# EasyEDA Pro project ProDoc_PCB2_2025-05-25.epro

# Board PCB2
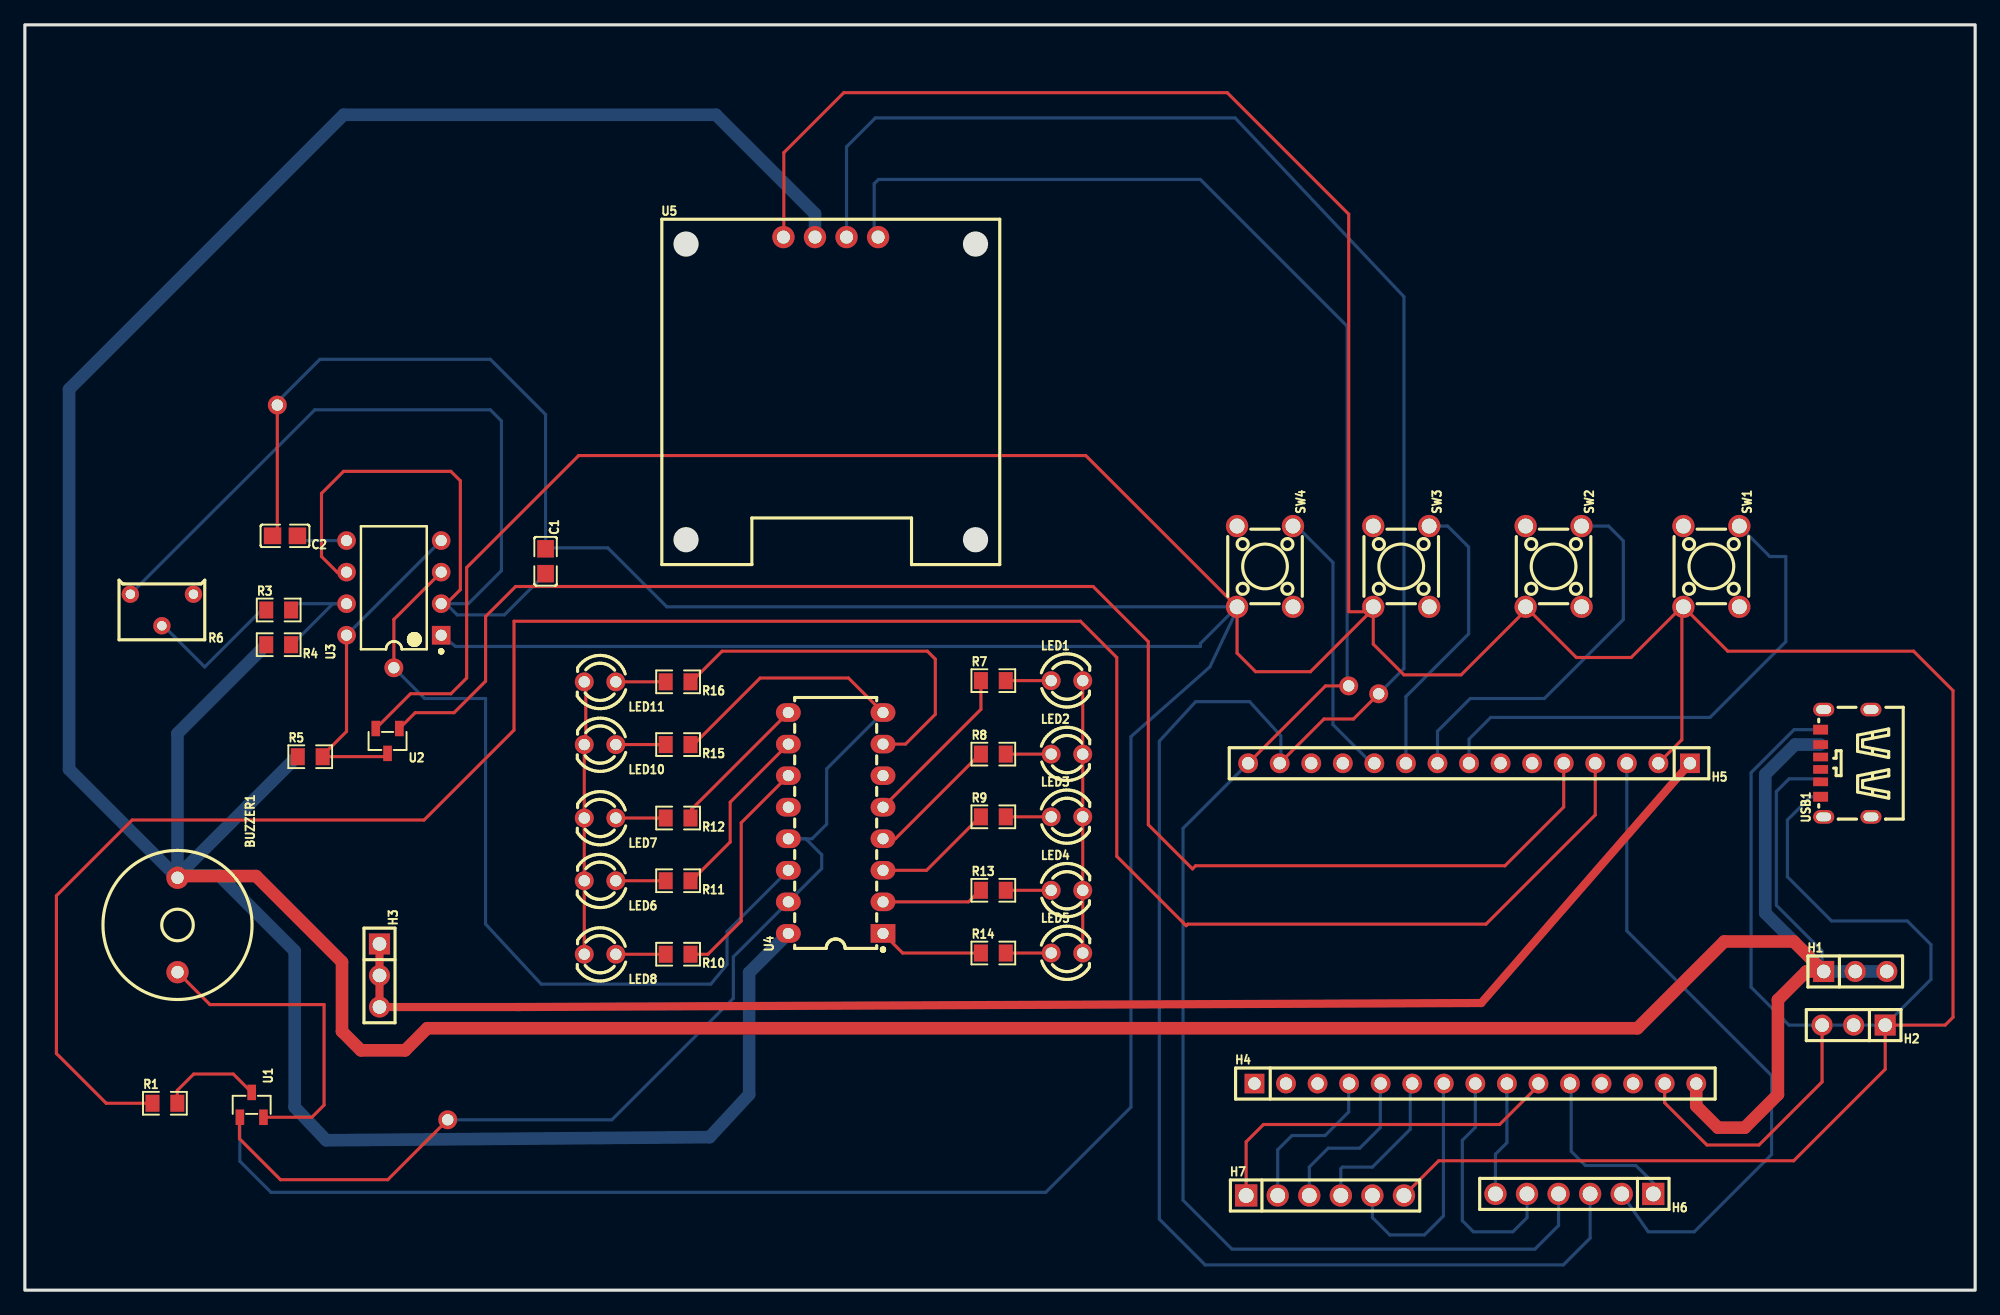
[diagram p0: board, top side]
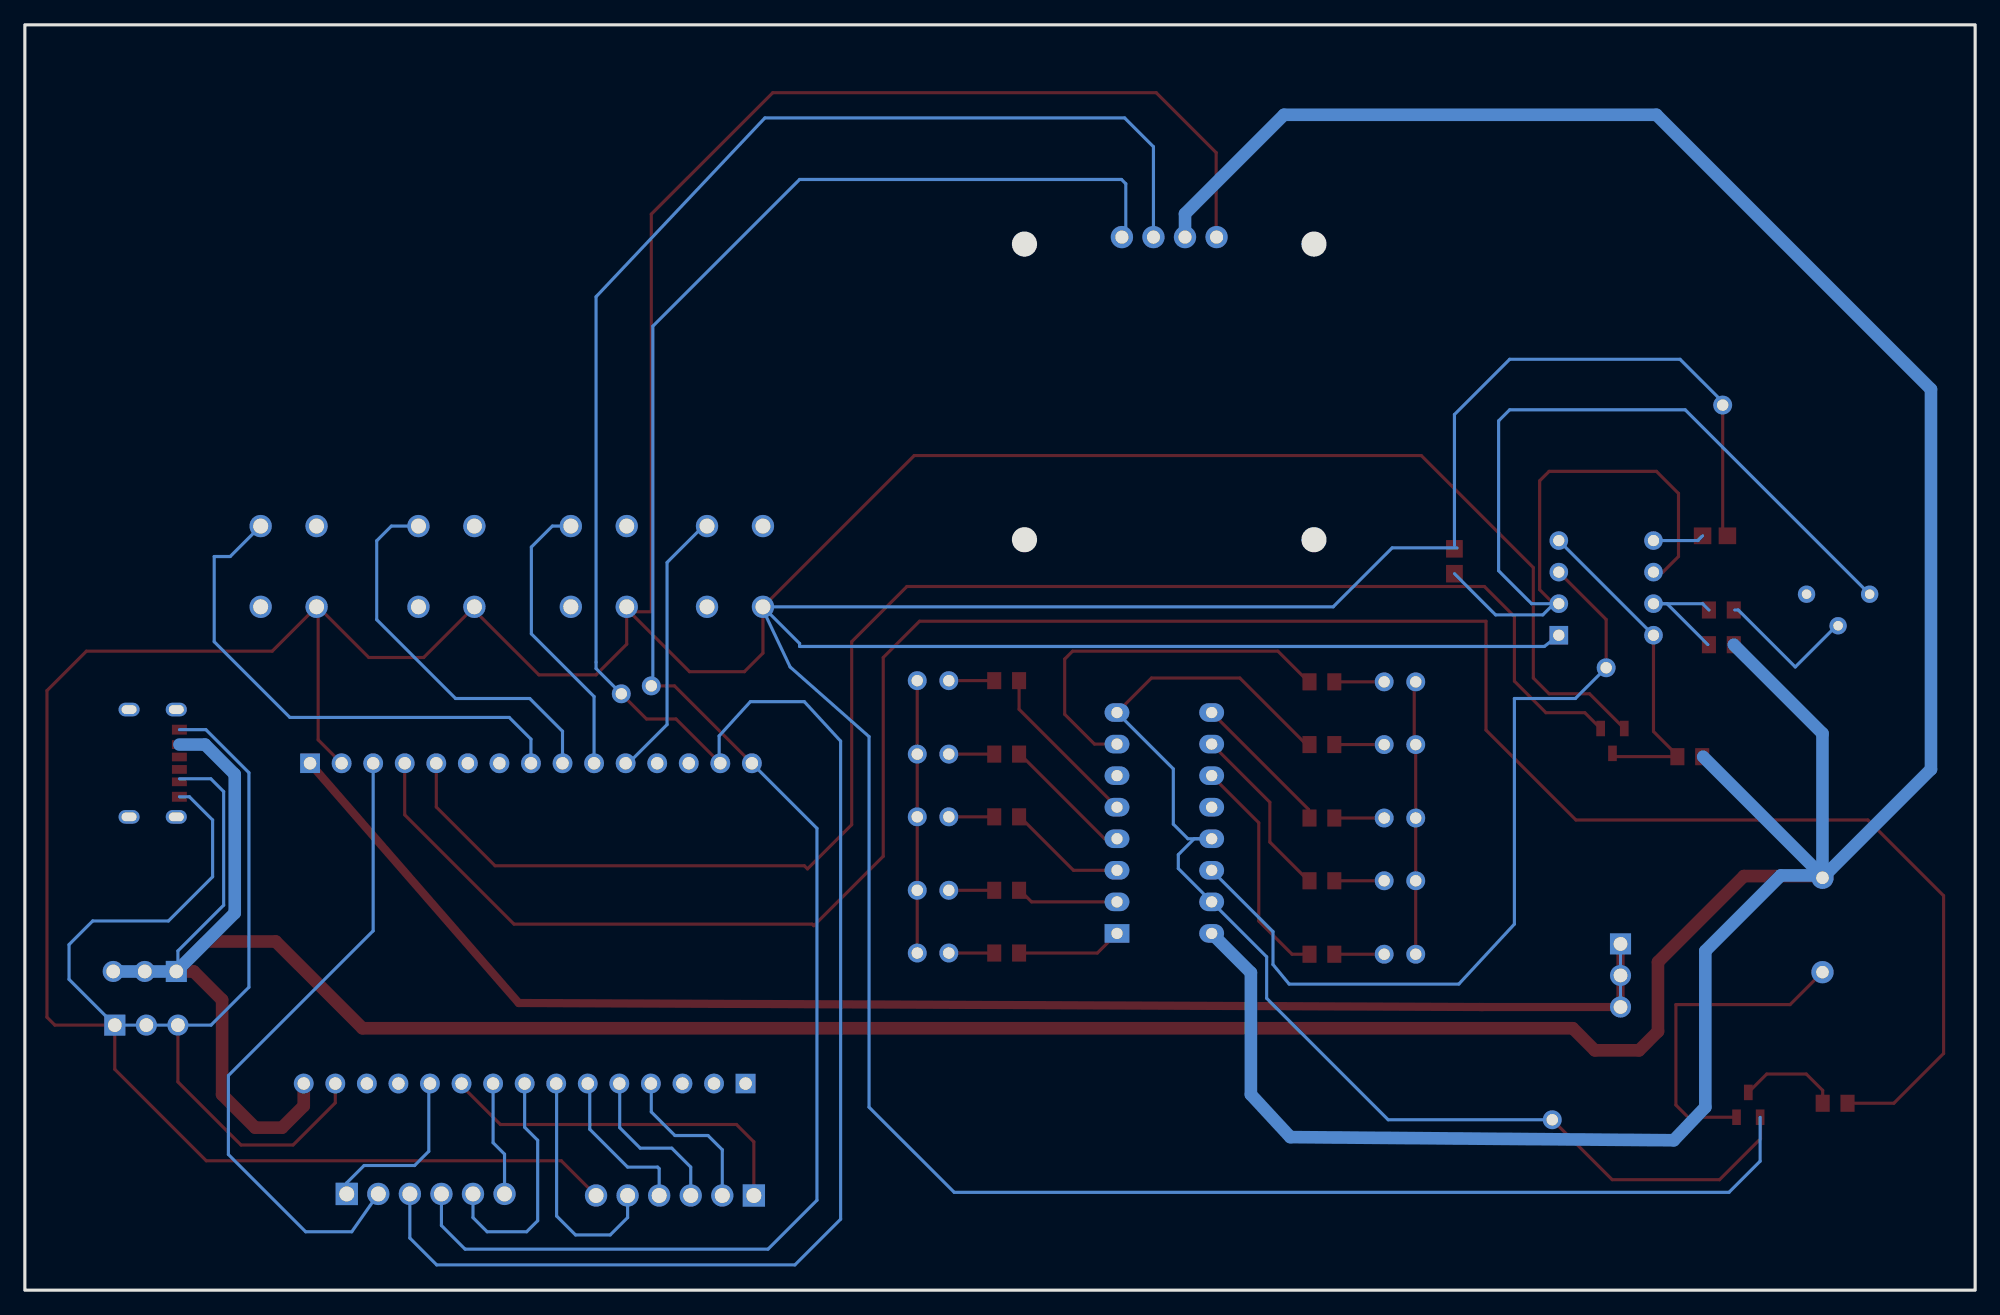
[diagram p1: board, bottom side, seen from below]

Outline 156.97 x 101.85 mm; copper layers: Top Layer, Bottom Layer. Coordinates in mm from the lower left corner of the outline.
Outline path: rectangle 0,101.85 156.97,0
Stack: Top Layer 0.035mm / Dielectric1 1.51mm FR4 er 4.5 / Bottom Layer 0.035mm

## Design rules (mm)
template: JLCPCB Capability(Two Layers Board)
spacing copperThickness1oz (default): track to track 0.102, other pairs 0.152 to 0.3
spacing copperThickness2oz: track to track 0.203, other pairs 0.152 to 0.3
track width copperThickness1oz (default): min 0.127, default 0.254, max 2.54
track width copperThickness2oz: min 0.203, default 0.254, max 2.54
differential pair differentialPair (default): width min 0.127, default 0.254, max 2.54; gap min 0.152, default 0.152
via viaSize (default): diameter min 0.5, default 0.61, max 10; hole min 0.3, default 0.305, max 6.3

## Placement (name value [footprint] x y rotation side)
BUZZER1  2.7kHz  [BUZ-TH_BD12.0-P7.60-D0.6-FD]  12.29 29.4 270 top
C1  10nF  [C0805]  41.91 58.67 270 top
C2  1uF  [C0805]  20.94 60.72 180 top
H1  PZ254V-11-03P  [HDR-TH_3P-P2.54-V-M]  147.32 25.65 0 top
H2  PZ254V-11-03P  [HDR-TH_3P-P2.54-V-M]  147.19 21.34 180 top
H3  PZ254V-11-03P  [HDR-TH_3P-P2.54-V-M]  28.54 25.33 270 top
H4  B-2200S15P-A120  [HDR-TH_15P-P2.54-V-F-1]  116.75 16.63 0 top
H5  B-2200S15P-A120  [HDR-TH_15P-P2.54-V-F-1]  116.24 42.41 180 top
H6  2.54-1x6P直针  [HDR-TH_6P-P2.54-V-M-1]  124.71 7.75 180 top
H7  2.54-1x6P直针  [HDR-TH_6P-P2.54-V-M-1]  104.65 7.62 0 top
LED1  204-10SURD/S530-A3  [LED-TH_BD3.0-P2.54-FD]  83.88 49.06 0 top
LED2  204-10SURD/S530-A3  [LED-TH_BD3.0-P2.54-FD]  83.88 43.15 0 top
LED3  204-10SURD/S530-A3  [LED-TH_BD3.0-P2.54-FD]  83.88 38.1 0 top
LED4  204-10SURD/S530-A3  [LED-TH_BD3.0-P2.54-FD]  83.88 32.19 0 top
LED5  204-10SURD/S530-A3  [LED-TH_BD3.0-P2.54-FD]  83.88 27.14 0 top
LED6  204-10SURD/S530-A3  [LED-TH_BD3.0-P2.54-FD]  46.3 32.96 180 top
LED7  204-10SURD/S530-A3  [LED-TH_BD3.0-P2.54-FD]  46.3 38 180 top
LED8  204-10SURD/S530-A3  [LED-TH_BD3.0-P2.54-FD]  46.3 27.04 180 top
LED10  204-10SURD/S530-A3  [LED-TH_BD3.0-P2.54-FD]  46.3 43.92 180 top
LED11  204-10SURD/S530-A3  [LED-TH_BD3.0-P2.54-FD]  46.3 48.97 180 top
NOREF  -  [Pad_e167]  34.04 13.72 0 top
NOREF#2  -  [Pad_e129]  108.97 48.01 0 top
NOREF#3  -  [Pad_e112]  29.7 50.1 0 top
NOREF#4  -  [Pad_e118]  20.32 71.25 0 top
NOREF#5  -  [Pad_e131]  106.55 48.64 0 top
R1  2.2kΩ  [R0805]  11.27 15.05 0 top
R3  10kΩ  [R0805]  20.43 54.75 0 top
R4  2.2kΩ  [R0805]  20.43 51.96 180 top
R5  22Ω  [R0805]  22.97 42.94 0 top
R6  500kΩ  [RES-ADJ-TH_3P-L7.1-W6.9-P2.54-BL-BS]  11.03 54.75 180 top
R7  470Ω  [R0805]  77.95 49.06 0 top
R8  470Ω  [R0805]  77.95 43.15 0 top
R9  470Ω  [R0805]  77.95 38.1 0 top
R10  470Ω  [R0805]  52.58 27.04 180 top
R11  470Ω  [R0805]  52.58 32.96 180 top
R12  470Ω  [R0805]  52.58 38 180 top
R13  470Ω  [R0805]  77.95 32.19 0 top
R14  470Ω  [R0805]  77.95 27.14 0 top
R15  470Ω  [R0805]  52.58 43.92 180 top
R16  470Ω  [R0805]  52.58 48.97 180 top
SW1  TS665CJ  [SW-TH_4P-L6.0-W6.0-P4.50-LS6.5]  135.74 58.26 270 top
SW2  TS665CJ  [SW-TH_4P-L6.0-W6.0-P4.50-LS6.5]  123.04 58.26 270 top
SW3  TS665CJ  [SW-TH_4P-L6.0-W6.0-P4.50-LS6.5]  110.78 58.26 270 top
SW4  TS665CJ  [SW-TH_4P-L6.0-W6.0-P4.50-LS6.5]  99.82 58.26 270 top
U1  SS8050  [SOT-23-3_L2.9-W1.3-P1.90-LS2.4-BR]  18.26 14.92 270 top
U2  2N7002K  [SOT-23-3_L2.9-W1.3-P1.90-LS2.4-BL-1]  29.19 44.21 180 top
U3  NE555N  [DIP-8_L9.8-W6.6-P2.54-LS7.6-BL]  29.7 56.53 90 top
U4  CD4017BE  [DIP-16_16P-L20.2-W6.6-P2.54-LS7.6-BL]  65.26 37.61 90 top
U5  HS96L03W2C03  [OLED-TH_L27.8-W27.2-P2.54_C9900033791]  64.87 84.77 0 top
USB1  TYPE-C 6P(073)  [TYPE-C-SMD_TYPE-C-6P_5]  146.56 42.42 90 top

## Footprints (pads in the part's own frame, mm; a bottom-side part is the same pattern mirrored in y, then rotated)
BUZ-TH_BD12.0-P7.60-D0.6-FD
  round 1.8 hole 1: 1(-3.8,0) 2(3.8,0)
C0805
  rect 1.41x1.35 smd: 1(-1,0) 2(1,0)
DIP-8_L9.8-W6.6-P2.54-LS7.6-BL
  rect 1.5x1.5 hole 0.9: 1(-3.81,-3.81)
  round 1.5 hole 0.9: 2(-1.27,-3.81) 3(1.27,-3.81) 4(3.81,-3.81) 5(3.81,3.81) 6(1.27,3.81) 7(-1.27,3.81) 8(-3.81,3.81)
DIP-16_16P-L20.2-W6.6-P2.54-LS7.6-BL
  rect 1.5x2 hole 0.9: 1(-8.89,-3.81)
  oval 1.5x2 hole 0.9: 2(-6.35,-3.81) 3(-3.81,-3.81) 4(-1.27,-3.81) 5(1.27,-3.81) 6(3.81,-3.81) 7(6.35,-3.81) 8(8.89,-3.81) 9(8.89,3.81) 10(6.35,3.81) 11(3.81,3.81) 12(1.27,3.81) 13(-1.27,3.81) 14(-3.81,3.81) 15(-6.35,3.81) 16(-8.89,3.81)
HDR-TH_3P-P2.54-V-M
  rect 1.7x1.7 hole 1.1: 1(-2.54,0)
  round 1.7 hole 1.1: 2(0,0) 3(2.54,0)
HDR-TH_6P-P2.54-V-M-1
  rect 1.8x1.8 hole 1.2: 1(-6.35,0)
  round 1.8 hole 1.2: 2(-3.81,0) 3(-1.27,0) 4(1.27,0) 5(3.81,0) 6(6.35,0)
HDR-TH_15P-P2.54-V-F-1
  rect 1.6x1.575 hole 1: 1(-17.78,0)
  round 1.6 hole 1: 2(-15.24,0) 3(-12.7,0) 4(-10.16,0) 5(-7.62,0) 6(-5.08,0) 7(-2.54,0) 8(0,0) 9(2.54,0) 10(5.08,0) 11(7.62,0) 12(10.16,0) 13(12.7,0) 14(15.24,0) 15(17.78,0)
LED-TH_BD3.0-P2.54-FD
  round 1.524 hole 0.914: 1(-1.27,0) 2(1.27,0)
OLED-TH_L27.8-W27.2-P2.54_C9900033791
  round 1.8 hole 1.05: 1(-3.81,0) 2(-1.27,0) 3(1.27,0) 4(3.81,0)
Pad_e112
  round 1.524 hole 0.914: 1(0,0)
Pad_e118
  round 1.524 hole 0.914: 1(0,0)
Pad_e129
  round 1.524 hole 0.914: 1(0,0)
Pad_e131
  round 1.524 hole 0.914: 1(0,0)
Pad_e167
  round 1.524 hole 0.914: 1(0,0)
R0805
  rect 1.133x1.377 smd: 1(-1,0) 2(1,0)
RES-ADJ-TH_3P-L7.1-W6.9-P2.54-BL-BS
  round 1.4 hole 0.762: 1(-2.54,-1.27) 2(0,1.27) 3(2.54,-1.27)
SOT-23-3_L2.9-W1.3-P1.90-LS2.4-BL-1
  rect 0.7x1.25 smd: 1(-0.95,-1) 2(0.95,-1) 3(0,1)
SOT-23-3_L2.9-W1.3-P1.90-LS2.4-BR
  rect 1.25x0.7 smd: 1(1,-0.95) 2(1,0.95) 3(-1,0)
SW-TH_4P-L6.0-W6.0-P4.50-LS6.5
  round 1.8 hole 1.2: 1(-3.25,2.25) 2(3.25,2.25) 3(-3.25,-2.25) 4(3.25,-2.25)
TYPE-C-SMD_TYPE-C-6P_5
  oval 1.1x1.7 hole 0.7x1.2: 7(-4.32,1.775) 7(-4.32,-2.025) 7(4.32,1.775) 7(4.32,-2.025)
  rect 0.7x1.2 smd: A5(-0.5,2.025) A9(1.5,2.025) B5(0.5,2.025) B9(-1.5,2.025)
  rect 0.8x1.2 smd: A12(2.7,2.025) B12(-2.7,2.025)

## Nets
GND: LED1.2 LED2.2 LED3.2 LED4.2 LED5.2 LED6.2 LED7.2 LED8.2 LED10.2 LED11.2
BEEP: H5.4
CONTROL: H5.5
D12: H4.12
D13: H4.13
D14: H4.11
D15: H5.3
D22: H5.14
D23: H5.15
D25: H4.8
D26: H4.9
D27: H4.10
D32: H4.6
D33: H4.7
D34: H4.4
D35: H4.5
NE555_5V: U3.8
SW1: H5.8
SW2: H5.9
SW3: H5.10
SW4: H5.11

Pads without a net: BUZZER1 1 2; C1 1 2; C2 1 2; H1 1 2 3; H2 1 2 3; H3 1 2 3; H4 1 2 3 14 15; H5 1 2 6 7 12 13; H6 1 2 3 4 5 6; H7 1 2 3 4 5 6; LED1 1; LED2 1; LED3 1; LED4 1; LED5 1; LED6 1; LED7 1; LED8 1; LED10 1; LED11 1; NOREF 1; NOREF#2 1; NOREF#3 1; NOREF#4 1; NOREF#5 1; R1 1 2; R3 1 2; R4 1 2; R5 1 2; R6 1 2 3; R7 1 2; R8 1 2; R9 1 2; R10 1 2; R11 1 2; R12 1 2; R13 1 2; R14 1 2; R15 1 2; R16 1 2; SW1 1 2 3 4; SW2 1 2 3 4; SW3 1 2 3 4; SW4 1 2 3 4; U1 1 2 3; U2 1 2 3; U3 1 2 3 4 5 6 7; U4 1 2 3 4 5 6 7 8 9 10 11 12 13 14 15 16; U5 1 2 3 4; USB1 7 A5 A9 A12 B5 B9 B12

## Routing (per net, layer and track width the routed paths; a pad name or vN(x,y) marks a point on that pad's centre or on a via; arc(x,y) is an arc through that point)
GND: length 43.9
  Top Layer w0.254: LED8.2 LED10.2 arc(45.12,44.05) 45.15,44.21 45.15,48.95 ; LED1.2 LED5.2
BEEP: length 187.5
  Top Layer w0.254: 10.2,15.05 6.55,15.05 2.54,19.05 2.54,31.75 8.64,37.85 32.13,37.85 39.37,45.09 39.37,53.85 84.96,53.85 87.88,50.93 87.88,34.93 93.47,29.34 93.6,29.46 117.6,29.46 126.4,38.26 H5.4
CONTROL: length 125.1
  Top Layer w0.254: 30.14,45.21 31.41,46.48 34.54,46.48 37.08,49.02 37.08,54.23 39.5,56.64 85.98,56.64 90.42,52.2 90.42,37.47 93.98,33.91 94.23,34.16 119.13,34.16 123.86,38.89 H5.5
D14: length 14
  Bottom Layer w0.254: H4.11 124.46,16.54 124.46,11.18 125.6,10.03 129.67,10.03 131.06,8.64 131.06,7.75
D15: length 52.5
  Bottom Layer w0.254: H5.3 128.94,28.92 140.59,17.27 140.59,10.92 134.37,4.7 130.66,4.7 128.52,7.75
D22: length 104
  Top Layer w0.254: H5.14 104.56,45.98 106.94,45.98 108.97,48.01
  Bottom Layer w0.254: H5.14 101.09,42.51 101.09,44.61 98.58,47.37 94.23,47.37 91.31,44.2 91.31,5.72 95,2.03 123.83,2.03 125.98,4.19 125.98,7.75
D23: length 83.2
  Top Layer w0.254: H5.15 104.68,48.64 106.55,48.64
  Bottom Layer w0.254: H5.15 93.22,37.17 93.22,7.24 97.16,3.3 121.54,3.3 123.44,5.21 123.44,7.75
D25: length 19.4
  Bottom Layer w0.254: H4.8 116.75,13.11 115.7,12.06 115.7,5.59 116.59,4.7 119.76,4.7 120.9,5.84 120.9,7.75
D26: length 9.3
  Bottom Layer w0.254: 118.36,7.75 118.36,10.95 119.28,11.87 H4.9
D27: length 29.7
  Top Layer w0.254: 98.3,7.62 98.3,11.94 99.69,13.34 118.7,13.34 121.83,16.46
D32: length 12.7
  Bottom Layer w0.254: 105.92,7.62 105.92,9.78 106.05,9.91 108.46,9.91 111.51,12.95 111.51,16.63
D33: length 19.1
  Bottom Layer w0.254: 108.46,7.62 108.46,5.84 109.86,4.45 112.65,4.45 114.17,5.97 114.17,16.38
D34: length 12.9
  Bottom Layer w0.254: 100.84,7.62 100.84,11.3 101.98,12.45 104.65,12.45 106.55,14.35 106.55,16.38 106.68,16.51
D35: length 12.9
  Bottom Layer w0.254: 103.38,7.62 103.38,9.91 104.9,11.43 107.44,11.43 109.09,13.08 109.09,16.6 H4.5
NE555_5V: length 26.8
  Top Layer w0.254: U3.8 25.89,44.97 23.86,42.95 28.93,42.95 29.19,43.21
  Bottom Layer w0.254: 33.51,60.34 U3.8
SW1: length 42.3
  Bottom Layer w0.254: H5.8 116.24,44.36 117.98,46.1 135.64,46.1 141.73,52.2 141.73,59.06 140.44,59.06 137.99,61.51
SW2: length 31.5
  Bottom Layer w0.254: H5.9 113.7,44.99 116.33,47.63 122.3,47.63 128.65,53.98 128.65,60.33 127.47,61.51 125.29,61.51
SW3: length 23.4
  Bottom Layer w0.254: H5.10 111.16,47.78 116.21,52.83 116.21,59.82 114.52,61.51 113.03,61.51
SW4: length 21.6
  Bottom Layer w0.254: 102.35,61.51 105.28,58.57 105.28,45.53 108.4,42.41
